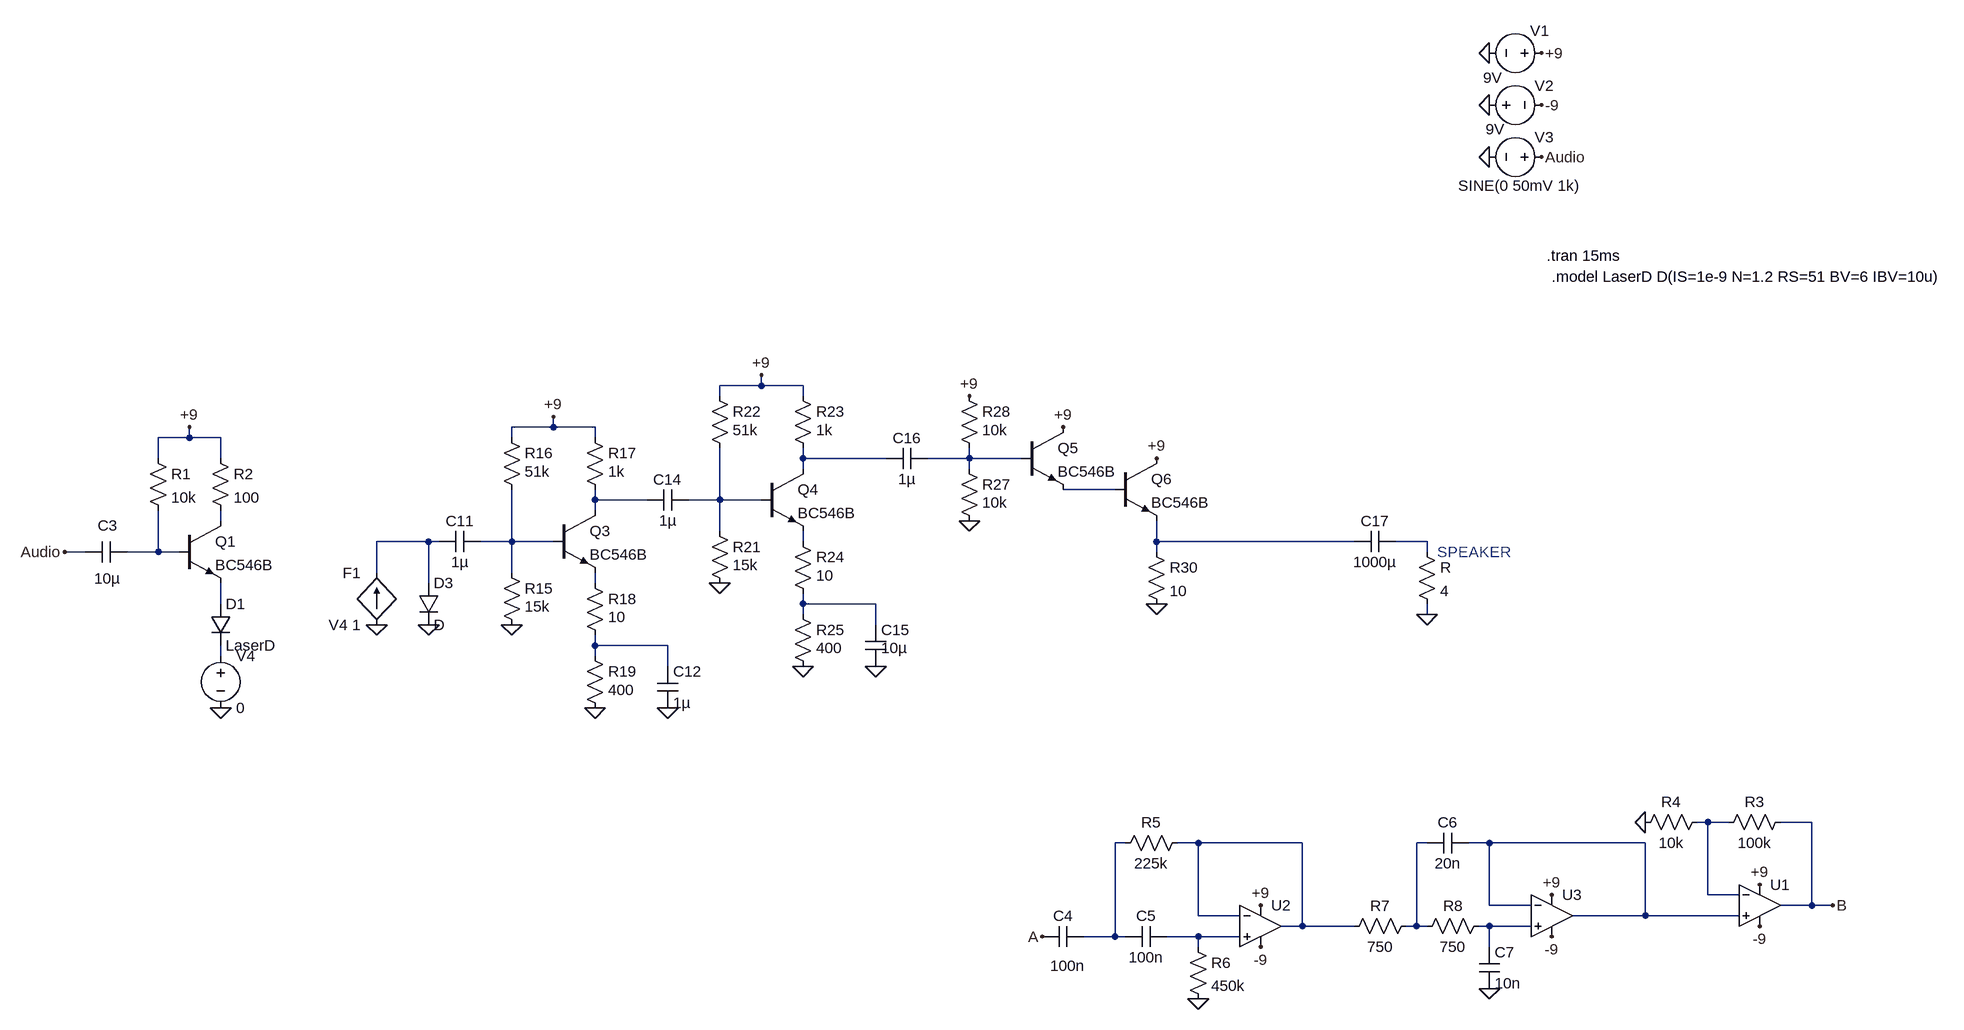
[diagram p0: schematic project_zeyneep.asc]
project_zeyneep.asc, the LTspice schematic file:
Version 4
SHEET 1 2692 1684
WIRE -480 720 -480 704
WIRE -480 720 -544 720
WIRE -416 720 -480 720
WIRE -544 736 -544 720
WIRE -416 736 -416 720
WIRE -800 784 -800 768
WIRE -800 784 -864 784
WIRE -736 784 -800 784
WIRE -1360 800 -1360 784
WIRE -1360 800 -1408 800
WIRE -1312 800 -1360 800
WIRE -864 800 -864 784
WIRE -736 800 -736 784
WIRE -1408 832 -1408 800
WIRE -1312 832 -1312 800
WIRE -416 832 -416 816
WIRE -288 832 -416 832
WIRE -160 832 -160 816
WIRE -160 832 -224 832
WIRE -80 832 -160 832
WIRE -416 848 -416 832
WIRE -160 848 -160 832
WIRE 64 880 -16 880
WIRE -736 896 -736 880
WIRE -656 896 -736 896
WIRE -544 896 -544 816
WIRE -544 896 -592 896
WIRE -480 896 -544 896
WIRE -736 912 -736 896
WIRE -1312 928 -1312 912
WIRE -544 944 -544 896
WIRE -992 960 -1072 960
WIRE -976 960 -992 960
WIRE -864 960 -864 880
WIRE -864 960 -912 960
WIRE -800 960 -864 960
WIRE -416 960 -416 944
WIRE 128 960 128 928
WIRE 432 960 128 960
WIRE 544 960 496 960
WIRE -1520 976 -1552 976
WIRE -1408 976 -1408 912
WIRE -1408 976 -1456 976
WIRE -1376 976 -1408 976
WIRE 128 976 128 960
WIRE 544 976 544 960
WIRE -1072 1008 -1072 960
WIRE -864 1008 -864 960
WIRE -992 1024 -992 960
WIRE -736 1024 -736 1008
WIRE -1312 1056 -1312 1024
WIRE -416 1056 -416 1040
WIRE -304 1056 -416 1056
WIRE -416 1072 -416 1056
WIRE 544 1072 544 1056
WIRE -304 1088 -304 1056
WIRE -736 1120 -736 1104
WIRE -624 1120 -736 1120
WIRE -1312 1136 -1312 1120
WIRE -736 1136 -736 1120
WIRE -624 1152 -624 1120
WIRE 976 1392 960 1392
WIRE 1008 1392 976 1392
WIRE 1136 1392 1088 1392
WIRE 80 1424 64 1424
WIRE 192 1424 160 1424
WIRE 352 1424 192 1424
WIRE 544 1424 528 1424
WIRE 640 1424 608 1424
WIRE 880 1424 640 1424
WIRE 976 1504 976 1392
WIRE 1024 1504 976 1504
WIRE 640 1520 640 1424
WIRE 704 1520 640 1520
WIRE 1136 1520 1136 1392
WIRE 1136 1520 1088 1520
WIRE 1168 1520 1136 1520
WIRE 192 1536 192 1424
WIRE 256 1536 192 1536
WIRE 880 1536 880 1424
WIRE 880 1536 768 1536
WIRE 1024 1536 880 1536
WIRE 352 1552 352 1424
WIRE 352 1552 320 1552
WIRE 432 1552 352 1552
WIRE 528 1552 528 1424
WIRE 528 1552 512 1552
WIRE 544 1552 528 1552
WIRE 640 1552 624 1552
WIRE 704 1552 640 1552
WIRE 64 1568 64 1424
WIRE 64 1568 16 1568
WIRE 80 1568 64 1568
WIRE 192 1568 144 1568
WIRE 256 1568 192 1568
WIRE 192 1584 192 1568
WIRE 640 1584 640 1552
FLAG 1056 1488 +9
FLAG 1056 1552 -9
FLAG 880 1392 0
FLAG 192 1664 0
FLAG 288 1520 +9
FLAG 736 1504 +9
FLAG 736 1568 -9
FLAG 288 1584 -9
FLAG 640 1648 0
FLAG -1360 784 +9
FLAG -864 1088 0
FLAG -800 768 +9
FLAG -544 1024 0
FLAG -480 704 +9
FLAG -416 1152 0
FLAG -304 1152 0
FLAG -160 928 0
FLAG -160 736 +9
FLAG -16 784 +9
FLAG 128 832 +9
FLAG 128 1056 0
FLAG 544 1072 0
FLAG -736 1216 0
FLAG -624 1216 0
FLAG -1072 1088 0
FLAG -992 1088 0
FLAG -1552 976 Audio
FLAG 640 288 0
FLAG 640 208 0
FLAG 720 208 +9
FLAG 720 288 -9
FLAG 640 368 0
FLAG 720 368 Audio
FLAG -1312 1216 0
FLAG -48 1568 A
FLAG 1168 1520 B
SYMBOL cap -1456 960 R90
WINDOW 0 -9 30 VBottom 2
WINDOW 3 41 30 VTop 2
SYMATTR InstName C3
SYMATTR Value 10µ
SYMBOL res -1424 816 R0
SYMATTR InstName R1
SYMATTR Value 10k
SYMBOL res -1328 816 R0
SYMATTR InstName R2
SYMATTR Value 100
SYMBOL diode -1328 1056 R0
SYMATTR InstName D1
SYMATTR Value LaserD
SYMBOL OpAmps\\UniversalOpAmp2 1056 1520 R0
SYMATTR InstName U1
SYMBOL res 1104 1376 R90
WINDOW 0 0 56 VBottom 2
WINDOW 3 32 56 VTop 2
SYMATTR InstName R3
SYMATTR Value 100k
SYMBOL res 864 1408 R270
WINDOW 0 32 56 VTop 2
WINDOW 3 0 56 VBottom 2
SYMATTR InstName R4
SYMATTR Value 10k
SYMBOL cap 16 1584 M270
WINDOW 0 32 32 VTop 2
WINDOW 3 -29 52 VLeft 2
SYMATTR InstName C4
SYMATTR Value 100n
SYMBOL cap 144 1552 R90
WINDOW 0 0 32 VBottom 2
WINDOW 3 32 32 VTop 2
SYMATTR InstName C5
SYMATTR Value 100n
SYMBOL res 176 1408 R90
WINDOW 0 0 56 VBottom 2
WINDOW 3 32 56 VTop 2
SYMATTR InstName R5
SYMATTR Value 225k
SYMBOL res 176 1568 R0
SYMATTR InstName R6
SYMATTR Value 450k
SYMBOL OpAmps\\UniversalOpAmp2 288 1552 R0
SYMATTR InstName U2
SYMBOL OpAmps\\UniversalOpAmp2 736 1536 R0
SYMATTR InstName U3
SYMBOL res 528 1536 R90
WINDOW 0 0 56 VBottom 2
WINDOW 3 32 56 VTop 2
SYMATTR InstName R7
SYMATTR Value 750
SYMBOL cap 608 1408 R90
WINDOW 0 0 32 VBottom 2
WINDOW 3 32 32 VTop 2
SYMATTR InstName C6
SYMATTR Value 20n
SYMBOL cap 624 1584 R0
SYMATTR InstName C7
SYMATTR Value 10n
SYMBOL res 640 1536 R90
WINDOW 0 0 56 VBottom 2
WINDOW 3 32 56 VTop 2
SYMATTR InstName R8
SYMATTR Value 750
SYMBOL cap -912 944 R90
WINDOW 0 0 32 VBottom 2
WINDOW 3 32 32 VTop 2
SYMATTR InstName C11
SYMATTR Value 1µ
SYMBOL res -880 992 R0
WINDOW 3 36 68 Left 2
SYMATTR Value 15k
SYMATTR InstName R15
SYMBOL res -880 784 R0
WINDOW 3 36 68 Left 2
SYMATTR Value 51k
SYMATTR InstName R16
SYMBOL res -752 784 R0
WINDOW 3 36 68 Left 2
SYMATTR Value 1k
SYMATTR InstName R17
SYMBOL npn -800 912 R0
SYMATTR InstName Q3
SYMATTR Value BC546B
SYMBOL cap -592 880 R90
WINDOW 0 0 32 VBottom 2
WINDOW 3 32 32 VTop 2
SYMATTR InstName C14
SYMATTR Value 1µ
SYMBOL res -560 928 R0
WINDOW 3 36 68 Left 2
SYMATTR Value 15k
SYMATTR InstName R21
SYMBOL res -560 720 R0
WINDOW 3 36 68 Left 2
SYMATTR Value 51k
SYMATTR InstName R22
SYMBOL res -432 720 R0
WINDOW 3 36 68 Left 2
SYMATTR Value 1k
SYMATTR InstName R23
SYMBOL npn -480 848 R0
SYMATTR InstName Q4
SYMATTR Value BC546B
SYMBOL res -432 944 R0
WINDOW 3 36 68 Left 2
SYMATTR Value 10
SYMATTR InstName R24
SYMBOL res -432 1056 R0
WINDOW 3 36 68 Left 2
SYMATTR Value 400
SYMATTR InstName R25
SYMBOL cap -320 1088 R0
WINDOW 3 24 36 Left 2
SYMATTR Value 10µ
SYMATTR InstName C15
SYMBOL cap -224 816 R90
WINDOW 0 0 32 VBottom 2
WINDOW 3 32 32 VTop 2
SYMATTR InstName C16
SYMATTR Value 1µ
SYMBOL res -176 832 R0
WINDOW 3 36 68 Left 2
SYMATTR Value 10k
SYMATTR InstName R27
SYMBOL res -176 720 R0
WINDOW 3 36 68 Left 2
SYMATTR Value 10k
SYMATTR InstName R28
SYMBOL npn -80 784 R0
SYMATTR InstName Q5
SYMATTR Value BC546B
SYMBOL npn 64 832 R0
SYMATTR InstName Q6
SYMATTR Value BC546B
SYMBOL cap 496 944 R90
WINDOW 0 0 32 VBottom 2
WINDOW 3 32 32 VTop 2
SYMATTR InstName C17
SYMATTR Value 1000µ
SYMBOL res 528 960 R0
SYMATTR InstName R
SYMATTR Value 4
SYMBOL res 112 960 R0
SYMATTR InstName R30
SYMATTR Value 10
SYMBOL res -752 1008 R0
WINDOW 3 36 68 Left 2
SYMATTR Value 10
SYMATTR InstName R18
SYMBOL res -752 1120 R0
WINDOW 3 36 68 Left 2
SYMATTR Value 400
SYMATTR InstName R19
SYMBOL cap -640 1152 R0
SYMATTR InstName C12
SYMATTR Value 1µ
SYMBOL diode -1008 1024 R0
SYMATTR InstName D3
SYMBOL voltage 736 208 R90
WINDOW 0 -34 4 VRight 2
WINDOW 3 38 76 VRight 2
WINDOW 123 0 0 Left 0
WINDOW 39 0 0 Left 0
SYMATTR InstName V1
SYMATTR Value 9V
SYMBOL voltage 624 288 R270
WINDOW 0 30 86 VRight 2
WINDOW 3 -37 10 VRight 2
WINDOW 123 0 0 Left 0
WINDOW 39 0 0 Left 0
SYMATTR InstName V2
SYMATTR Value 9V
SYMBOL voltage 736 368 R90
WINDOW 0 -46 12 VTop 2
WINDOW 3 60 50 VBottom 2
WINDOW 123 0 0 Left 0
WINDOW 39 0 0 Left 0
SYMATTR InstName V3
SYMATTR Value SINE(0 50mV 1k)
SYMBOL npn -1376 928 R0
SYMATTR InstName Q1
SYMATTR Value BC546B
SYMBOL voltage -1312 1120 R0
SYMATTR InstName V4
SYMATTR Value 0
SYMBOL f -1072 1088 R180
WINDOW 0 24 80 Left 2
WINDOW 3 24 0 Left 2
SYMATTR InstName F1
SYMATTR Value V4 1
TEXT 728 520 Left 2 !.tran 15ms
TEXT 736 552 Left 2 !.model LaserD D(IS=1e-9 N=1.2 RS=51 BV=6 IBV=10u)
TEXT 560 976 Left 2 ;SPEAKER

The netlist it stands for:
* project_zeyneep.asc
C3 N012 Audio 10µ
R1 +9 N012 10k
R2 +9 N006 100
D1 N014 N017 LaserD
XU1 N022 N018 +9 -9 B level2 Avol=1Meg GBW=10Meg Slew=10Meg Ilimit=25m Rail=0 Vos=0 En=0 Enk=0 In=0 Ink=0 Rin=500Meg  ; pins In+ In- V+ V- OUT
R3 B N018 100k
R4 0 N018 10k
C4 N019 A 100n
C5 N024 N019 100n
R5 N020 N019 225k
R6 N024 0 450k
XU2 N024 N020 +9 -9 N020 level2 Avol=1Meg GBW=10Meg Slew=10Meg Ilimit=25m Rail=0 Vos=0 En=0 Enk=0 In=0 Ink=0 Rin=500Meg  ; pins In+ In- V+ V- OUT
XU3 N023 N022 +9 -9 N022 level2 Avol=1Meg GBW=10Meg Slew=10Meg Ilimit=25m Rail=0 Vos=0 En=0 Enk=0 In=0 Ink=0 Rin=500Meg  ; pins In+ In- V+ V- OUT
R7 N021 N020 750
C6 N022 N021 20n
C7 N023 0 10n
R8 N023 N021 750
C11 N008 N007 1µ
R15 N008 0 15k
R16 +9 N008 51k
R17 +9 N004 1k
Q3 N004 N008 N013 0 BC546B
C14 N005 N004 1µ
R21 N005 0 15k
R22 +9 N005 51k
R23 +9 N001 1k
Q4 N001 N005 N009 0 BC546B
R24 N009 N015 10
R25 N015 0 400
C15 N015 0 10µ
C16 N002 N001 1µ
R27 N002 0 10k
R28 +9 N002 10k
Q5 +9 N002 N003 0 BC546B
Q6 +9 N003 N010 0 BC546B
C17 N011 N010 1000µ
R N011 0 4
R30 N010 0 10
R18 N013 N016 10
R19 N016 0 400
C12 N016 0 1µ
D3 N007 0 D
V1 +9 0 9V
V2 0 -9 9V
V3 Audio 0 SINE(0 50mV 1k)
Q1 N006 N012 N014 0 BC546B
V4 N017 0 0
F1 0 N007 V4 1
.model D D
.lib standard.dio
.model NPN NPN
.model PNP PNP
.lib standard.bjt
.tran 15ms
.model LaserD D(IS=1e-9 N=1.2 RS=51 BV=6 IBV=10u)
* SPEAKER
.lib UniversalOpAmp2.lib
.backanno
.end